# Altium schematic sheet STM32H730_PINOUT.SchDoc
size C; SheetNumber: 7; SheetTotal: 10
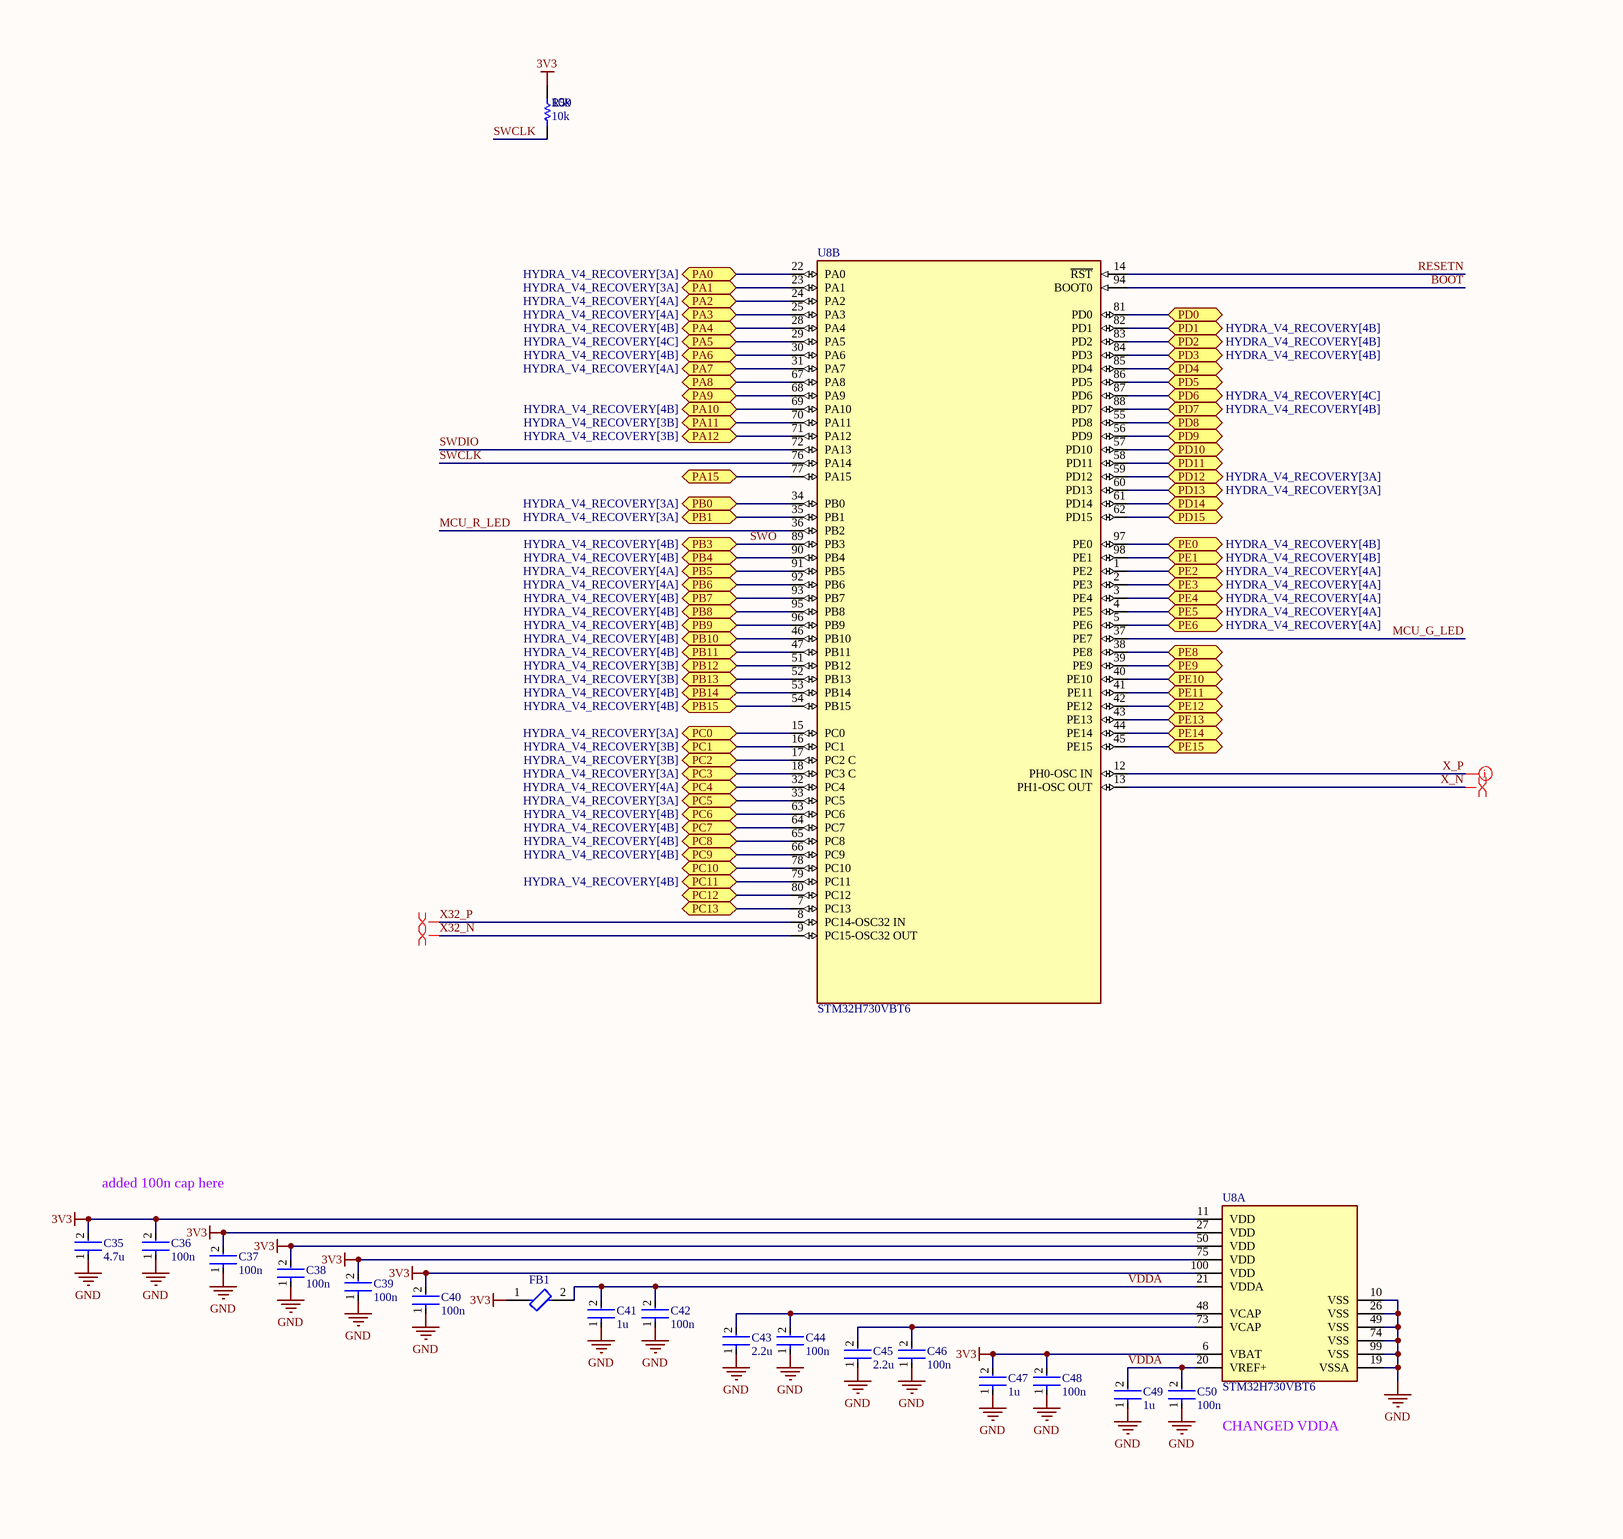
[diagram p0: STM32H730_PINOUT.SchDoc, left]
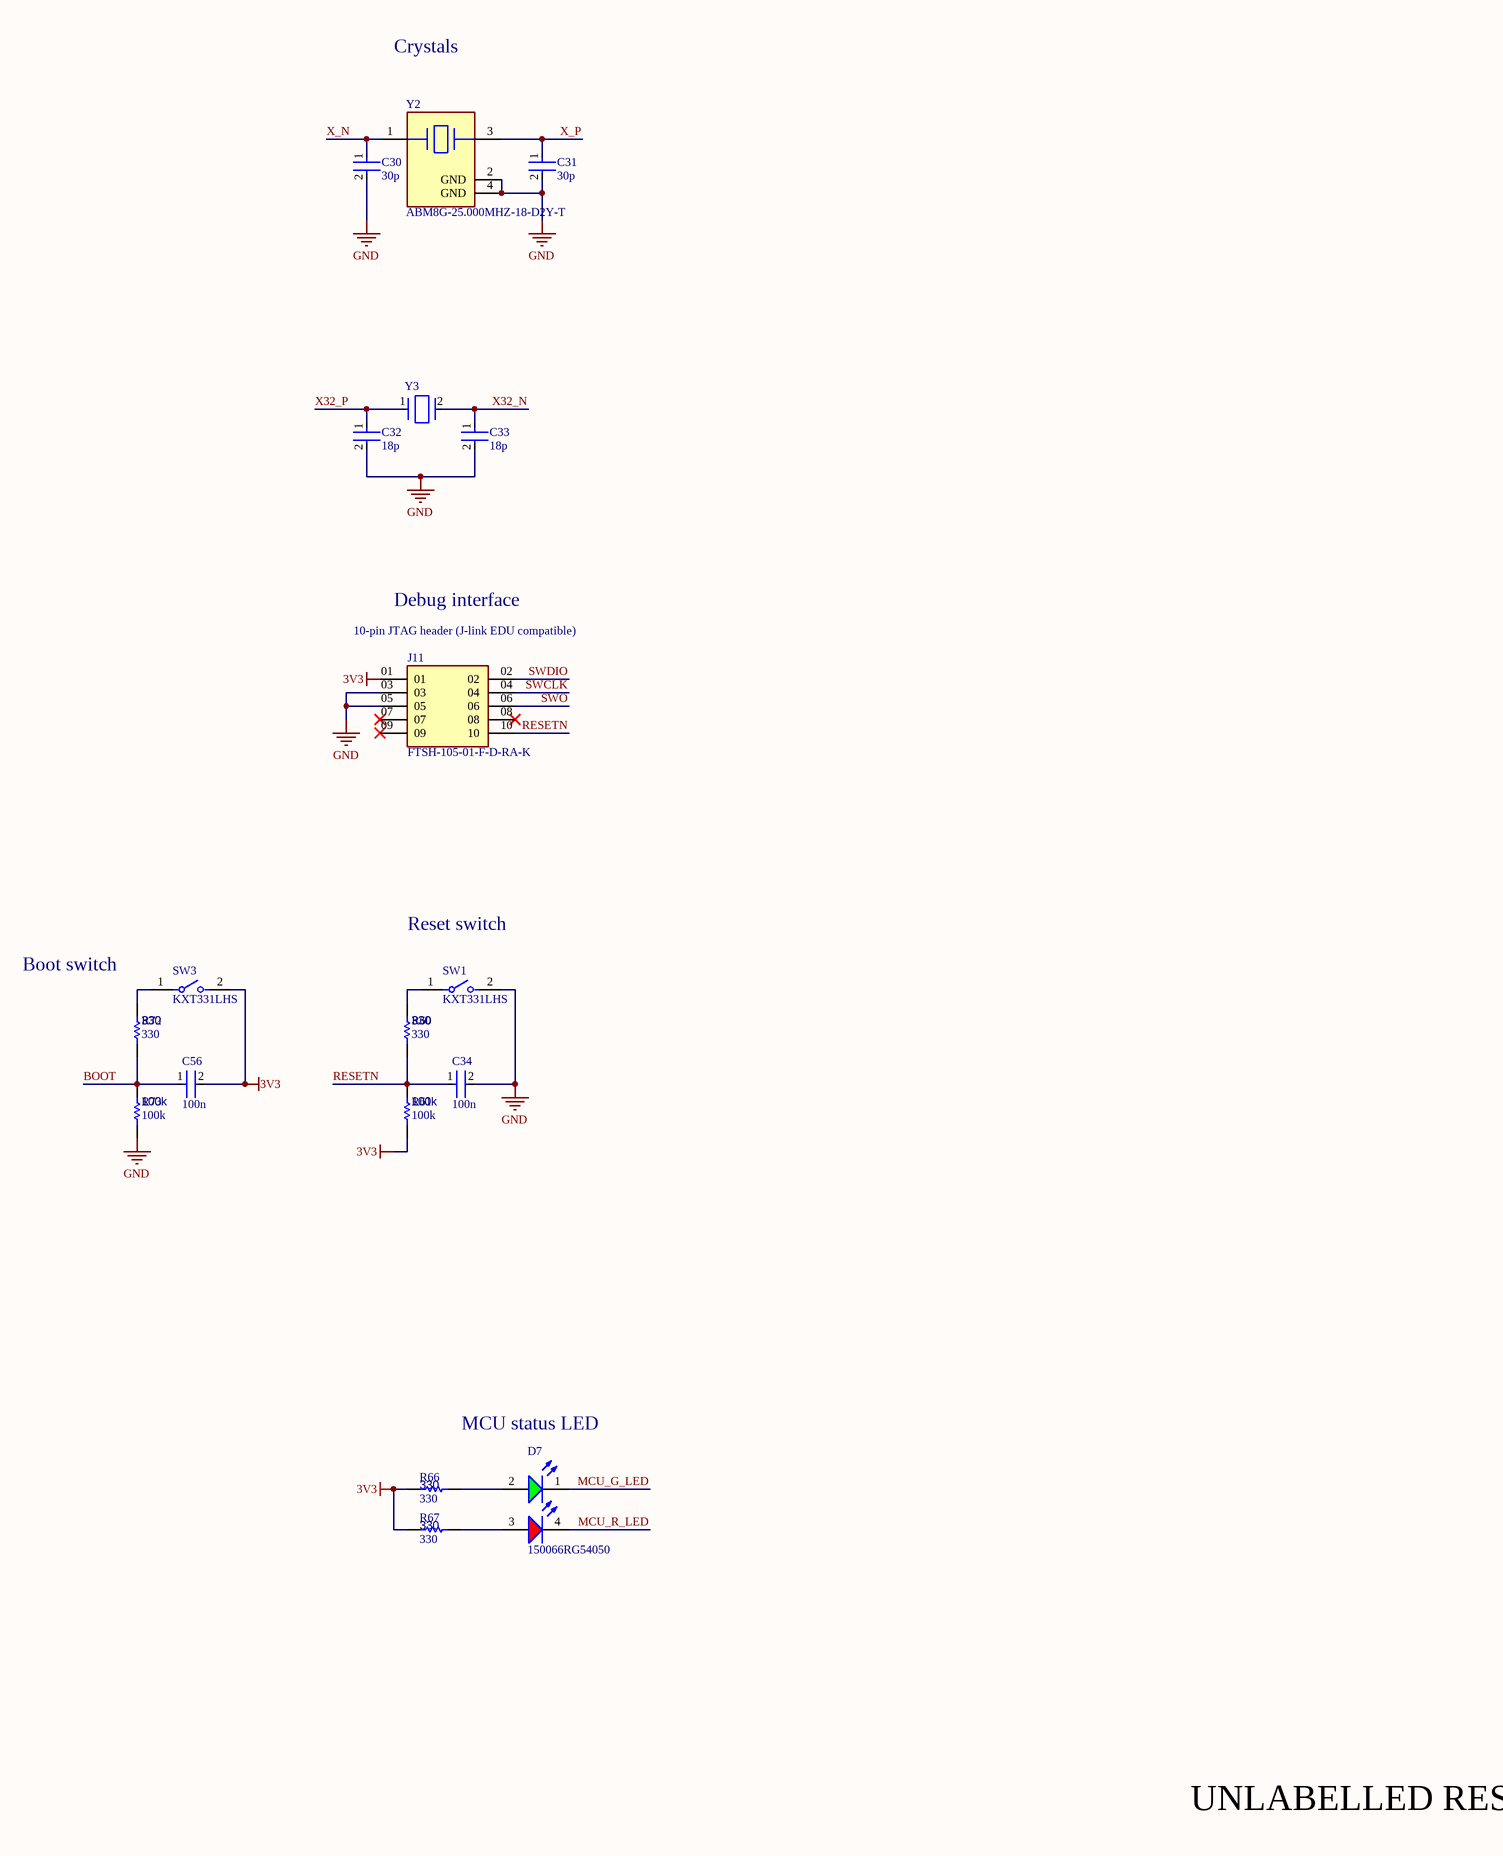
[diagram p1: STM32H730_PINOUT.SchDoc, right]

## Parts
C30  30p  [FP-0402-L_1_0_0_05-W_0_5-IPC_A]
C31  30p  [FP-0402-L_1_0_0_05-W_0_5-IPC_A]
C32  18p  [FP-0402-L_1_0_0_05-W_0_5-IPC_A]
C33  18p  [FP-0402-L_1_0_0_05-W_0_5-IPC_A]
C34  100n  [FP-0402-L_1_0_0_05-W_0_5-IPC_A]
C35  4.7u  [FP-0402-L_1_0_0_05-W_0_5-IPC_A]
C36  100n  [FP-0402-L_1_0_0_05-W_0_5-IPC_A]
C37  100n  [FP-0402-L_1_0_0_05-W_0_5-IPC_A]
C38  100n  [FP-0402-L_1_0_0_05-W_0_5-IPC_A]
C39  100n  [FP-0402-L_1_0_0_05-W_0_5-IPC_A]
C40  100n  [FP-0402-L_1_0_0_05-W_0_5-IPC_A]
C41  1u  [FP-0402-L_1_0_0_05-W_0_5-IPC_A]
C42  100n  [FP-0402-L_1_0_0_05-W_0_5-IPC_A]
C43  2.2u  [FP-0402-L_1_0_0_05-W_0_5-IPC_A]
C44  100n  [FP-0402-L_1_0_0_05-W_0_5-IPC_A]
C45  2.2u  [FP-0402-L_1_0_0_05-W_0_5-IPC_A]
C46  100n  [FP-0402-L_1_0_0_05-W_0_5-IPC_A]
C47  1u  [FP-0402-L_1_0_0_05-W_0_5-IPC_A]
C48  100n  [FP-0402-L_1_0_0_05-W_0_5-IPC_A]
C49  1u  [FP-0402-L_1_0_0_05-W_0_5-IPC_A]
C50  100n  [FP-0402-L_1_0_0_05-W_0_5-IPC_A]
C56  100n  [FP-0402-L_1_0_0_05-W_0_5-IPC_A]
D7  150066RG54050  [WL-SBCD_0606]
FB1  BLM15PX601SN1D  [FP-BLM15-0_05-MFG]  (value not drawn)
J11  FTSH-105-01-F-D-RA-K  [FTSH-105-01-F-D-RA-K-Footprint-1]
R59  10k  [R0603B]
R60  330  [R0603B]
R61  100k  [R0603B]
R66  330  [R0603B]
R67  330  [R0603B]
R72  330  [R0603B]
R73  100k  [R0603B]
SW1  KXT331LHS  [FP-KXT331LHS-MFG]
SW3  KXT331LHS  [FP-KXT331LHS-MFG]
U8  STM32H730VBT6  [FP-LQFP100-1L-IPC_C]  (parts A,B of 2)
Y2  ABM8G-25.000MHZ-18-D2Y-T  [FP-ABM8G-MFG]
Y3  ECS-.327-12.5-1210-TR  [FP-ECX-1210-MFG]  (value not drawn)

## Ports
PA0 (bidir, see HYDRA_V4_RECOVERY[3A]), PA1 (bidir, see HYDRA_V4_RECOVERY[3A]), PA2 (bidir, see HYDRA_V4_RECOVERY[4A]), PA3 (bidir, see HYDRA_V4_RECOVERY[4A]), PA4 (bidir, see HYDRA_V4_RECOVERY[4B]), PA5 (bidir, see HYDRA_V4_RECOVERY[4C]), PA6 (bidir, see HYDRA_V4_RECOVERY[4B]), PA7 (bidir, see HYDRA_V4_RECOVERY[4A]), PA8 (bidir), PA9 (bidir), PA10 (bidir, see HYDRA_V4_RECOVERY[4B]), PA11 (bidir, see HYDRA_V4_RECOVERY[3B]), PA12 (bidir, see HYDRA_V4_RECOVERY[3B]), PA15 (bidir), PB0 (bidir, see HYDRA_V4_RECOVERY[3A]), PB1 (bidir, see HYDRA_V4_RECOVERY[3A]), PB3 (bidir, see HYDRA_V4_RECOVERY[4B]), PB4 (bidir, see HYDRA_V4_RECOVERY[4B]), PB5 (bidir, see HYDRA_V4_RECOVERY[4A]), PB6 (bidir, see HYDRA_V4_RECOVERY[4A]), PB7 (bidir, see HYDRA_V4_RECOVERY[4B]), PB8 (bidir, see HYDRA_V4_RECOVERY[4B]), PB9 (bidir, see HYDRA_V4_RECOVERY[4B]), PB10 (bidir, see HYDRA_V4_RECOVERY[4B]), PB11 (bidir, see HYDRA_V4_RECOVERY[4B]), PB12 (bidir, see HYDRA_V4_RECOVERY[3B]), PB13 (bidir, see HYDRA_V4_RECOVERY[3B]), PB14 (bidir, see HYDRA_V4_RECOVERY[4B]), PB15 (bidir, see HYDRA_V4_RECOVERY[4B]), PC0 (bidir, see HYDRA_V4_RECOVERY[3A]), PC1 (bidir, see HYDRA_V4_RECOVERY[3B]), PC2 (bidir, see HYDRA_V4_RECOVERY[3B]), PC3 (bidir, see HYDRA_V4_RECOVERY[3A]), PC4 (bidir, see HYDRA_V4_RECOVERY[4A]), PC5 (bidir, see HYDRA_V4_RECOVERY[3A]), PC6 (bidir, see HYDRA_V4_RECOVERY[4B]), PC7 (bidir, see HYDRA_V4_RECOVERY[4B]), PC8 (bidir, see HYDRA_V4_RECOVERY[4B]), PC9 (bidir, see HYDRA_V4_RECOVERY[4B]), PC10 (bidir), PC11 (bidir, see HYDRA_V4_RECOVERY[4B]), PC12 (bidir), PC13 (bidir), PD0 (bidir), PD1 (bidir, see HYDRA_V4_RECOVERY[4B]), PD2 (bidir, see HYDRA_V4_RECOVERY[4B]), PD3 (bidir, see HYDRA_V4_RECOVERY[4B]), PD4 (bidir), PD5 (bidir), PD6 (bidir, see HYDRA_V4_RECOVERY[4C]), PD7 (bidir, see HYDRA_V4_RECOVERY[4B]), PD8 (bidir), PD9 (bidir), PD10 (bidir), PD11 (bidir), PD12 (bidir, see HYDRA_V4_RECOVERY[3A]), PD13 (bidir, see HYDRA_V4_RECOVERY[3A]), PD14 (bidir), PD15 (bidir), PE0 (bidir, see HYDRA_V4_RECOVERY[4B]), PE1 (bidir, see HYDRA_V4_RECOVERY[4B]), PE2 (bidir, see HYDRA_V4_RECOVERY[4A]), PE3 (bidir, see HYDRA_V4_RECOVERY[4A]), PE4 (bidir, see HYDRA_V4_RECOVERY[4A]), PE5 (bidir, see HYDRA_V4_RECOVERY[4A]), PE6 (bidir, see HYDRA_V4_RECOVERY[4A]), PE8 (bidir), PE9 (bidir), PE10 (bidir), PE11 (bidir), PE12 (bidir), PE13 (bidir), PE14 (bidir), PE15 (bidir)

## Nets
3V3: C35.2 C36.2 C37.2 C38.2 C39.2 C40.2 C47.2 C48.2 C56.2 FB1.1 J11.01 R59.2 R61.1 R66.2 R67.2 SW3.2 U8.6(VBAT) U8.11(VDD) U8.27(VDD) U8.50(VDD) U8.75(VDD) U8.100(VDD)
GND: C30.2 C31.2 C32.2 C33.2 C34.2 C35.1 C36.1 C37.1 C38.1 C39.1 C40.1 C41.1 C42.1 C43.1 C44.1 C45.1 C46.1 C47.1 C48.1 C49.1 C50.1 J11.03 J11.05 R73.1 SW1.2 U8.10(VSS) U8.19(VSSA) U8.26(VSS) U8.49(VSS) U8.74(VSS) U8.99(VSS) Y2.2(GND) Y2.4(GND)
BOOT: C56.1 R72.2 R73.2 U8.94(BOOT0)
MCU_G_LED: D7.1(K) U8.37(PE7)
MCU_R_LED: D7.4(K) U8.36(PB2)
PA0: U8.22(PA0) ; port PA0
PA1: U8.23(PA1) ; port PA1
PA2: U8.24(PA2) ; port PA2
PA3: U8.25(PA3) ; port PA3
PA4: U8.28(PA4) ; port PA4
PA5: U8.29(PA5) ; port PA5
PA6: U8.30(PA6) ; port PA6
PA7: U8.31(PA7) ; port PA7
PA8: U8.67(PA8) ; port PA8
PA9: U8.68(PA9) ; port PA9
PA10: U8.69(PA10) ; port PA10
PA11: U8.70(PA11) ; port PA11
PA12: U8.71(PA12) ; port PA12
PA15: U8.77(PA15) ; port PA15
PB0: U8.34(PB0) ; port PB0
PB1: U8.35(PB1) ; port PB1
PB4: U8.90(PB4) ; port PB4
PB5: U8.91(PB5) ; port PB5
PB6: U8.92(PB6) ; port PB6
PB7: U8.93(PB7) ; port PB7
PB8: U8.95(PB8) ; port PB8
PB9: U8.96(PB9) ; port PB9
PB10: U8.46(PB10) ; port PB10
PB11: U8.47(PB11) ; port PB11
PB12: U8.51(PB12) ; port PB12
PB13: U8.52(PB13) ; port PB13
PB14: U8.53(PB14) ; port PB14
PB15: U8.54(PB15) ; port PB15
PC0: U8.15(PC0) ; port PC0
PC1: U8.16(PC1) ; port PC1
PC2: U8.17(PC2_C) ; port PC2
PC3: U8.18(PC3_C) ; port PC3
PC4: U8.32(PC4) ; port PC4
PC5: U8.33(PC5) ; port PC5
PC6: U8.63(PC6) ; port PC6
PC7: U8.64(PC7) ; port PC7
PC8: U8.65(PC8) ; port PC8
PC9: U8.66(PC9) ; port PC9
PC10: U8.78(PC10) ; port PC10
PC11: U8.79(PC11) ; port PC11
PC12: U8.80(PC12) ; port PC12
PC13: U8.7(PC13) ; port PC13
PD0: U8.81(PD0) ; port PD0
PD1: U8.82(PD1) ; port PD1
PD2: U8.83(PD2) ; port PD2
PD3: U8.84(PD3) ; port PD3
PD4: U8.85(PD4) ; port PD4
PD5: U8.86(PD5) ; port PD5
PD6: U8.87(PD6) ; port PD6
PD7: U8.88(PD7) ; port PD7
PD8: U8.55(PD8) ; port PD8
PD9: U8.56(PD9) ; port PD9
PD10: U8.57(PD10) ; port PD10
PD11: U8.58(PD11) ; port PD11
PD12: U8.59(PD12) ; port PD12
PD13: U8.60(PD13) ; port PD13
PD14: U8.61(PD14) ; port PD14
PD15: U8.62(PD15) ; port PD15
PE0: U8.97(PE0) ; port PE0
PE1: U8.98(PE1) ; port PE1
PE2: U8.1(PE2) ; port PE2
PE3: U8.2(PE3) ; port PE3
PE4: U8.3(PE4) ; port PE4
PE5: U8.4(PE5) ; port PE5
PE6: U8.5(PE6) ; port PE6
PE8: U8.38(PE8) ; port PE8
PE9: U8.39(PE9) ; port PE9
PE10: U8.40(PE10) ; port PE10
PE11: U8.41(PE11) ; port PE11
PE12: U8.42(PE12) ; port PE12
PE13: U8.43(PE13) ; port PE13
PE14: U8.44(PE14) ; port PE14
PE15: U8.45(PE15) ; port PE15
RESETN: C34.1 J11.10 R60.1 R61.2 U8.14(~{RST})
SWCLK: J11.04 R59.1 U8.76(PA14)
SWDIO: J11.02 U8.72(PA13)
SWO: J11.06 U8.89(PB3) ; port PB3
VDDA: C41.2 C42.2 C49.2 C50.2 FB1.2 U8.20(VREF+) U8.21(VDDA)
X32_N: C33.1 U8.9(PC15-OSC32_OUT) Y3.2(Out/In)
X32_P: C32.1 U8.8(PC14-OSC32_IN) Y3.1(In/Out)
X_N: C30.1 U8.13(PH1-OSC_OUT) Y2.1
X_P: C31.1 U8.12(PH0-OSC_IN) Y2.3
NetC43_2: C43.2 C44.2 U8.48(VCAP)
NetC45_2: C45.2 C46.2 U8.73(VCAP)
NetD7_2: D7.2(A) R66.1
NetD7_3: D7.3(A) R67.1
NetR60_2: R60.2 SW1.1
NetR72_1: R72.1 SW3.1

Not connected (* = marked no-connect by the designer): J11 07* 08* 09*

## Layout directives
differential pair: X32_N, X32_P, X_N, X_P

## Notes on the sheet
- Crystals
- (near J11) 10-pin JTAG header (J-link EDU compatible)
- Debug interface
- Boot switch
- Reset switch
- added 100n cap here
- CHANGED VDDA
- MCU status LED
- UNLABELLED RESISTORS ARE JUMPERS

## Library data of the parts
C30-C50 C56 = CMP-001-00058-1: LARGE PADS, 0402 CAP, CHANGE COMMENT TO MATCH REAL P/N; Capacitor Type: Ceramic; Min Operating Temperature: -55°C; Mounting Technology: Surface Mount; Pins: 2; Case/Package: 0402; RoHS Compliant: Yes; Max Operating Temperature: 85°C
  C30 C31: Value: 30p
  C32 C33: Value: 18p
  C34 C36-C40 C42 C44 C46 C48 C50 C56: Value: 100n
  C35: Value: 4.7u
  C41 C47 C49: Value: 1u
  C43 C45: Value: 2.2u
D7 = CMP-004-00040-2: Led, Red/Grn, 180Mcd/230Mcd, 624Nm/525Nm Rohs Compliant: Yes; Source: rgled.SchLib; Component Type: Standard; Design Item ID: CMP-004-00034-2; Pins: 4
FB1 = CMP-0686-00252-4: Chip Ferrite Bead, 0402, 600Ω @ 100MHz, 0.23Ω, 25%, 900mA; Number of Circuits: 1; Impedance: 600R; DC Resistance (DCR): 230mR; Material: Steel; Length: 1mm; Package Quantity: 10000; Height: 0.5mm; Width: 0.5mm; Max DC Current: 900mA; Number of Lines: 1; Termination: SMD/SMT; Packaging: Tape and Reel; Lead Free: Lead Free; Min Operating Temperature: -55°C; Max Operating Temperature: 125°C; Max Current Rating: 900mA; Case Code (Imperial): 0402; Number of Pins: 2; Current Rating: 900mA; Test Frequency: 100MHz; Case/Package: 0402; Tolerance: 25%; Case Code (Metric): 1005
J11 = CMP-002-00041-5: Board Connector, 10 Contact(s), 2 Row(s), Male, Right Angle, 0.05 inch Pitch, Surface Mount Terminal, Locking, Black Insulator; Connector Type: BOARD CONNECTOR; Mounting Technology: Board; RoHS Compliant: Yes
R59-R61 R66 R67 R72 R73 = CMP-009-00002-14: Resistor
  R59: Value: 10k
  R60 R66 R67 R72: Value: 330
  R61 R73: Value: 100k
SW1 SW3 = CMP-10040-000029-1: SWITCH TACTILE SPST-NO 0.02A 15V; Operating Force: 240gf; Switch Travel: 0.13mm; Illumination Type: Non-Illuminated; Throw Configuration: SPST; Number of Ports: 1; Current Rating: 5A; Mechanical Life: 500000Cycles; Switch Function: Off-Mom; Connector Type: USB; Actuator Type: Standard; Gender: Receptacle; Number of Contacts: 24; Contact Plating: Gold; Insulation Color: Black; Min Operating Temperature: -40°C; Packaging: Tape and Reel; Flammability Rating: UL94 V-0; Max Operating Temperature: 85°C; Termination: Solder; Mount: Surface Mount
U8 = CMP-12105-000107-1: IC MCU 32BIT 128KB FLASH 100LQFP
Y2 = CMP-2000-05733-3: Crystal 25MHz ±20ppm (Tol) ±30ppm (Stability) 18pF FUND 60Ω 4-Pin SMD T/R; Series Resistance: 60R; Length: 3.2mm; Depth: 2.5mm; Packaging: Tape and Reel; Min Operating Temperature: -40°C; Operating Frequency: 25 MHz; Lead Free: Lead Free; Number of Pins: 4; Frequency Tolerance: 20ppm; Radiation Hardening: No; Max Operating Temperature: 85°C; Termination: SMD/SMT; Frequency Stability: 30ppm; Frequency: 25MHz; Series: ABM8G; Mount: Surface Mount; Package Quantity: 1000; Height: 0.039inch; Width: 0.098inch; Case/Package: CSMD; ESR (Equivalent Series Resistance): 60R; Load Capacitance: 18pF; Tolerance: 20ppm
Y3 = CMP-40224-000006-1: CRYSTAL 32.7680KHZ 12.5PF SMD; Manufacturer: ECS International; Frequency: 32.768kHz; Esr: 90kΩ; Tolerance: 20ppm; Device Class L1: Passive Components; Load Capacitance: 12.5pF; Temperature: -40°C to +85°C; ComponentLink2URL: https://ecsxtal.com/store/pdf/ECX-1210.pdf; Series: ECX-1210; Octopart: https://octopart.com/ecs-.327-12.5-1210-tr-ecs+international-81221340; ComponentLink2Description: Datasheet; Temperature Range Low: -40°C; Digikey Description: CRYSTAL 32.7680KHZ 12.5PF SMD; Lead Free: Yes; RoHS: TRUE; Device Class L3: Crystals; Automotive: No; Category: Crys; Height: 0.5mm; Manufacturer Part Number: ECS-.327-12.5-1210-TR; Temperature Range High: +85°C; Device Class L2: Crystals / Oscillators; Package: ECX-1210